# Altium schematic sheet 4G.SchDoc: 4G
size A3; Organization: Altium Limited; Address1: L3, 12a Rodborough Rd; Address2: Frenchs Forest; Address3: NSW; Address4: Australia 2086; Stage: DRAFT
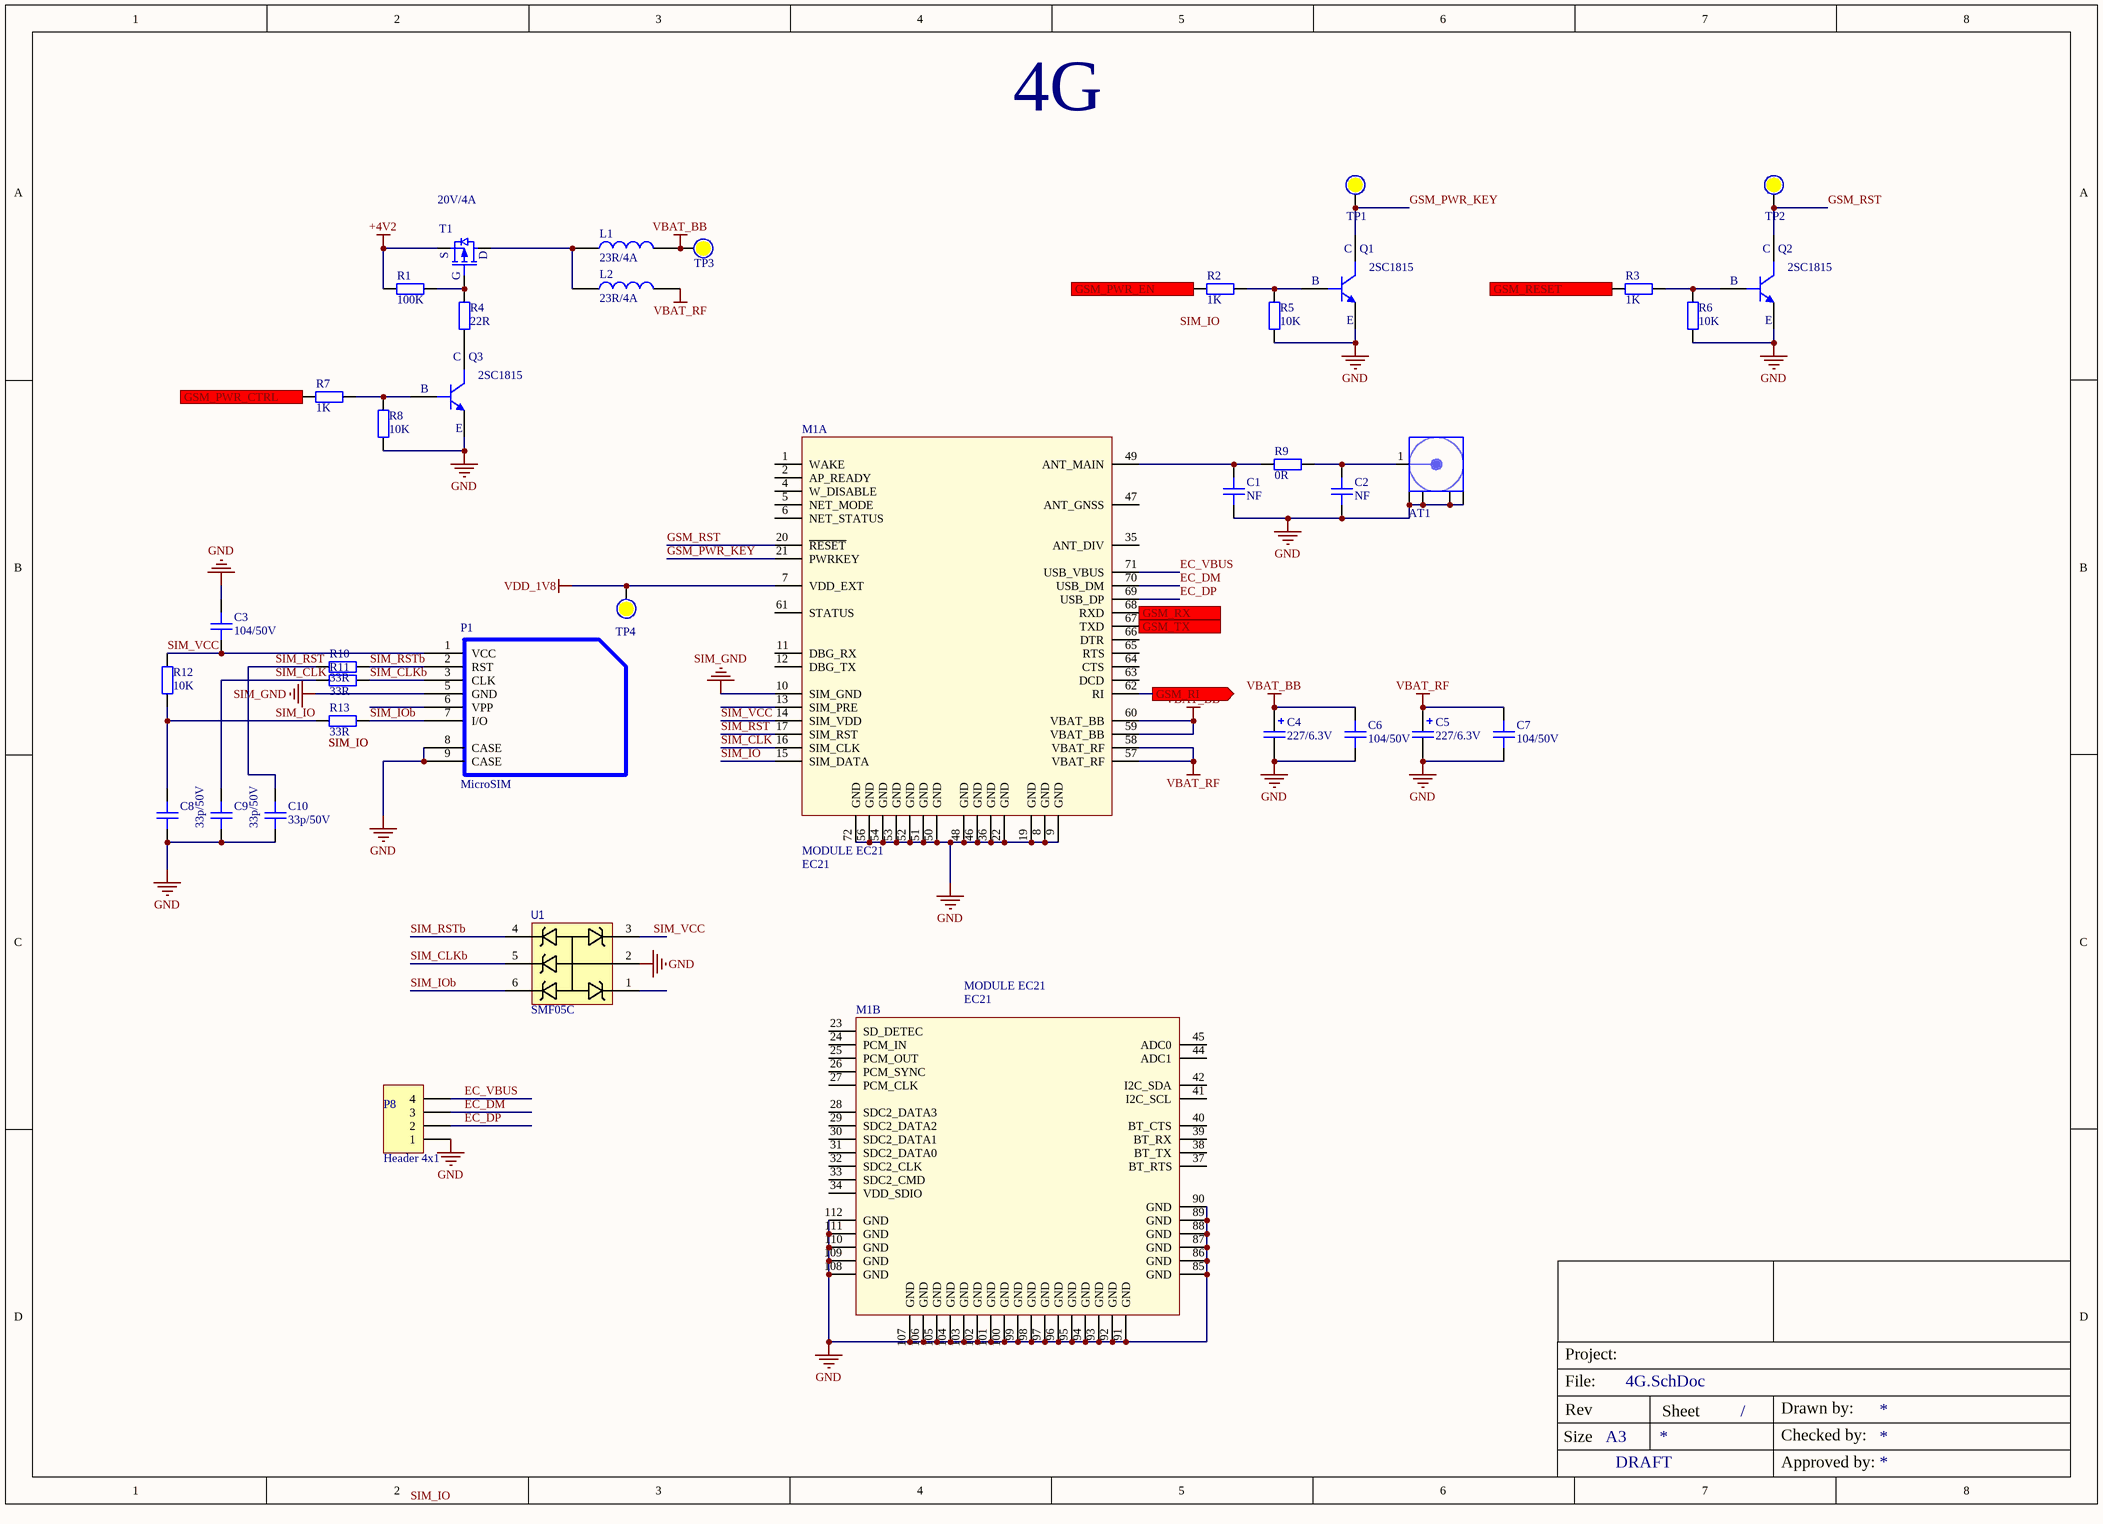
[diagram p0: 4G.SchDoc]

## Parts
AT1  AT-GSM-GPS  [SNW_H11-L17-SMA]  (value not drawn)
C1  NF  [CAPC-0603 (1608)]
C2  NF  [CAPC-0603 (1608)]
C3  104/50V  [CAPC-0603 (1608)]
C4  227/6.3V  [CAP_TANTAL_1210(3528)]
C5  227/6.3V  [CAP_TANTAL_1210(3528)]
C6  104/50V  [CAPC-0603 (1608)]
C7  104/50V  [CAPC-0603 (1608)]
C8  33p/50V  [CAPC-0603 (1608)]
C9  33p/50V  [CAPC-0603 (1608)]
C10  33p/50V  [CAPC-0603 (1608)]
L1  23R/4A  [IND-0603 (1608)]
L2  23R/4A  [IND-0603 (1608)]
M1  MODULE EC21  Part Number: EC21  [QUECTEL_EC20]  (parts A,B of 3)
P1  MicroSIM  [MUP-C792]
P8  Header 4x1  [HDR1X4]
Q1  2SC1815  [SOT23_3]
Q2  2SC1815  [SOT23_3]
Q3  2SC1815  [SOT23_3]
R1  100K  [RESC-0603 (1608)]
R2  1K  [RESC-0603 (1608)]
R3  1K  [RESC-0603 (1608)]
R4  22R  [RESC-0603 (1608)]
R5  10K  [RESC-0603 (1608)]
R6  10K  [RESC-0603 (1608)]
R7  1K  [RESC-0603 (1608)]
R8  10K  [RESC-0603 (1608)]
R9  0R  [RESC-0603 (1608)]
R10  33R  [RESC-0603 (1608)]
R11  33R  [RESC-0603 (1608)]
R12  10K  [RESC-0603 (1608)]
R13  33R  [RESC-0603 (1608)]
T1  20V/4A  [SOT23_3]
TP1  (no value)  [Test Point 1.5 MM]  (no BOM)
TP2  (no value)  [Test Point 1.5 MM]  (no BOM)
TP3  (no value)  [Test Point 1.5 MM]  (no BOM)
TP4  (no value)  [Test Point 1.5 MM]  (no BOM)
U1  SMF05C  [SOT65P210X140-6N]

## Ports
GSM_PWR_CTRL (in), GSM_PWR_EN (in), GSM_RESET (in), GSM_RI (out), GSM_RX (in), GSM_TX (out)

## Nets
+4V2: R1.1 T1.2(S)
GND: AT1.2 C1.1 C2.1 C3.2 C4.2 C5.2 C6.1 C7.1 C8.1 C9.1 C10.1 M1.8(GND) M1.9(GND) M1.19(GND) M1.22(GND) M1.36(GND) M1.46(GND) M1.48(GND) M1.50(GND) M1.51(GND) M1.52(GND) M1.53(GND) M1.54(GND) M1.56(GND) M1.72(GND) M1.85(GND) M1.86(GND) M1.87(GND) M1.88(GND) M1.89(GND) M1.90(GND) M1.91(GND) M1.92(GND) M1.93(GND) M1.94(GND) M1.95(GND) M1.96(GND) M1.97(GND) M1.98(GND) M1.99(GND) M1.100(GND) M1.101(GND) M1.102(GND) M1.103(GND) M1.104(GND) M1.105(GND) M1.106(GND) M1.107(GND) M1.108(GND) M1.109(GND) M1.110(GND) M1.111(GND) M1.112(GND) P1.8(CASE) P1.9(CASE) P8.1 Q1.2(E) Q2.2(E) Q3.2(E) R5.1 R6.1 R8.1 U1.2(AN)
SIM_GND: M1.10(SIM_GND) P1.5(GND)
VBAT_BB: C4.1 C6.2 L1.2 M1.59(VBAT_BB) M1.60(VBAT_BB) TP3.0
VBAT_RF: C5.1 C7.2 L2.2 M1.57(VBAT_RF) M1.58(VBAT_RF)
VDD_1V8: M1.7(VDD_EXT) TP4.0
EC_DM: M1.70(USB_DM) P8.3
EC_DP: M1.69(USB_DP) P8.2
EC_VBUS: M1.71(USB_VBUS) P8.4
GSM_PWR_CTRL: R7.1 ; port GSM_PWR_CTRL
GSM_PWR_EN: R2.1 ; port GSM_PWR_EN
GSM_PWR_KEY: M1.21(PWRKEY) Q1.3(C) TP1.0
GSM_RESET: R3.1 ; port GSM_RESET
GSM_RI: M1.62(RI) ; port GSM_RI
GSM_RST: M1.20(~{RESET}) Q2.3(C) TP2.0
GSM_RX: M1.68(RXD) ; port GSM_RX
GSM_TX: M1.67(TXD) ; port GSM_TX
SIM_CLK: C9.2 M1.16(SIM_CLK) R11.2
SIM_CLKb: P1.3(CLK) R11.1 U1.5(CT4)
SIM_IO: C8.2 M1.15(SIM_DATA) R12.1 R13.2
SIM_IOb: P1.7(I/O) R13.1 U1.6(CT5)
SIM_RST: C10.2 M1.17(SIM_RST) R10.2
SIM_RSTb: P1.2(RST) R10.1 U1.4(CT3)
SIM_VCC: C3.1 M1.14(SIM_VDD) P1.1(VCC) R12.2 U1.3(CT2)
NetAT1_1: AT1.1(Signal) C2.2 R9.2
NetC1_2: C1.2 M1.49(ANT_MAIN) R9.1
NetL1_1: L1.1 L2.1 T1.3(D)
NetQ1_1: Q1.1(B) R2.2 R5.2
NetQ2_1: Q2.1(B) R3.2 R6.2
NetQ3_1: Q3.1(B) R7.2 R8.2
NetQ3_3: Q3.3(C) R4.1
NetR1_2: R1.2 R4.2 T1.1(G)

Not connected (* = marked no-connect by the designer): M1 1(WAKE) 2(AP_READY) 4(W_DISABLE) 5(NET_MODE) 6(NET_STATUS) 11(DBG_RX) 12(DBG_TX) 13(SIM_PRE) 23(SD_DETEC) 24(PCM_IN) 25(PCM_OUT) 26(PCM_SYNC) 27(PCM_CLK) 28(SDC2_DATA3) 29(SDC2_DATA2) 30(SDC2_DATA1) 31(SDC2_DATA0) 32(SDC2_CLK) 33(SDC2_CMD) 34(VDD_SDIO) 35(ANT_DIV) 37(BT_RTS) 38(BT_TX) 39(BT_RX) 40(BT_CTS) 41(I2C_SCL) 42(I2C_SDA) 44(ADC1) 45(ADC0) 47(ANT_GNSS) 61(STATUS) 63(DCD) 64(CTS) 65(RTS) 66(DTR); P1 6(VPP); U1 1(CT1)

## Notes on the sheet
- Labels drawn without touching a wire or pin: SIM_IO
- Project:
- File:
- Size
- Rev
- A3
- Sheet
- /
- Drawn by:
- Checked by:
- Approved by:

## Library data of the parts
AT1 = SNW_H11-L17-SMA: CONNECTER ANTENNA GPS GSM; MFR: Sunny Way; Solder: HAND; MPN: SNW_H11-L17-SMA; Value: AT-GSM-GPS; ClassName: MECHANICAL
C1 C2 = CAPC NF 0603: CAP SMD, Not Fill, 0603; Solder: Not Fill; Value: NF; Category: CAPACITOR
C3 C6 C7 = C0603C104K5RACTU: CAP CER 0.1uF 50V 10% X7R 0603; CompanyID: VT-00982; Solder: SMT; MPN: C0603C104K5RACTU; Value: 104/50V; Category: CAPACITOR
C4 C5 = T520B227M006ATE035: CAP TANT POLY 220uF 20% 6.3V 3528 35mOhm ESR; Solder: SMT; CompanyID: VT-00643; Value: 227/6.3V; MPN: T520B227M006ATE035; Category: CAPACITOR
C8-C10 = 0603N330J500CT: CAP CER 33pF 50V 5%  0603; MPN: CL10C330JB8NNNC; CompanyID: VT-01106; Solder: SMT; Value: 33p/50V; Category: CAPACITOR
L1 L2 = FBMJ1608HM230NT: IND-FERRITE BEAD 23 OHM  4A 0603 1LN; CompanyID: VT-01060; Solder: SMT; MPN: FBMJ1608HM230NT; Value: 23R/4A; Category: FERRITE BEAD
M1 = QUECTEL EC21: Quectel EC21 is a series of LTE category; Brand: Quectel
P1 = MUP-C792: MicroSIM Card Push - Push Holder; MFR: MUP; MPN: C792; Solder: SMT; ClassName: MECHANICAL
P8 = Header 4x1: Header, 4 Pin Pitch 2.54mm; MPN: S1012EC-40-ND; Solder: WAVE; Value: Header 4P; ClassName: MECHANICAL
Q1-Q3 = 2SC1815: TRANS NPN 50V 0.15A SOT23-3; Solder: SMT; MPN: 2SC1815; Value: 2SC1815
R1 = RC0603FR-07100KL: RES SMD 100K OHM 1% 1/10W 0603; CompanyID: VT-00332; Solder: SMT; MPN: RC0603FR-07100KL; Value: 100K; Category: RESISTOR
R2 R3 R7 = RC0603FR-071KL: RES SMD 1 KOHM 1% 1/10W 0603; CompanyID: VT-00574; Solder: SMT; MPN: RC0603FR-071KL; Value: 1K; Category: RESISTOR
R4 = RC0603FR-0722RL: RES SMD 22 OHM 1% 1/10W 0603; CompanyID: VT-00881; Solder: SMT; Value: 22R; MPN: RC0603FR-0722RL; Category: RESISTOR
R5 R6 R8 R12 = RC0603FR-0710KL: RES SMD 10K OHM 1% 1/10W 0603; CompanyID: VT-00328; Solder: SMT; MPN: RC0603FR-0710KL; Value: 10K; Category: RESISTOR
R9 = RC0603FR-070RL: RES SMD 0.0OHM JUMPER 1/10W 0603; CompanyID: VT-00901; Solder: SMT; MPN: RC0603FR-070RL; Value: 0R; Category: RESISTOR
R10 R11 R13 = RC0603FR-0733RL: RES SMD 33 OHM 1% 1/10W 0603; MFR: Yageo; Solder: SMT; MPN: RC0603FR-0733RL; Value: 33R; Category: RESISTOR
T1 = AO3415: MOSFET P-CH 20V 4A SOT23; MFR: Alpha & Omega Semiconductor Inc.; Solder: SMT; Value: 20V/4A; MPN: AO3415
TP1-TP4 = Test Point: Solder: NF
U1 = SMF05C: TVS Diode Array For ESD and Latch-Up Protection; MFR: ON SEMICONDUCTOR; Value: SMF05CT2G; Solder: SMT; CompanyID: VT-0; ComponentLink1URL: http://www.onsemi.com/pub/Collateral/SMF05C-D.PDF; ComponentLink1Description: http://www.onsemi.com/pub/Collateral/SMF05C-D.PDF; MPN: SMF05CT2G; Category: IC